# EAGLE design Arduino-Pro-Mini (EAGLE 7.3.0)
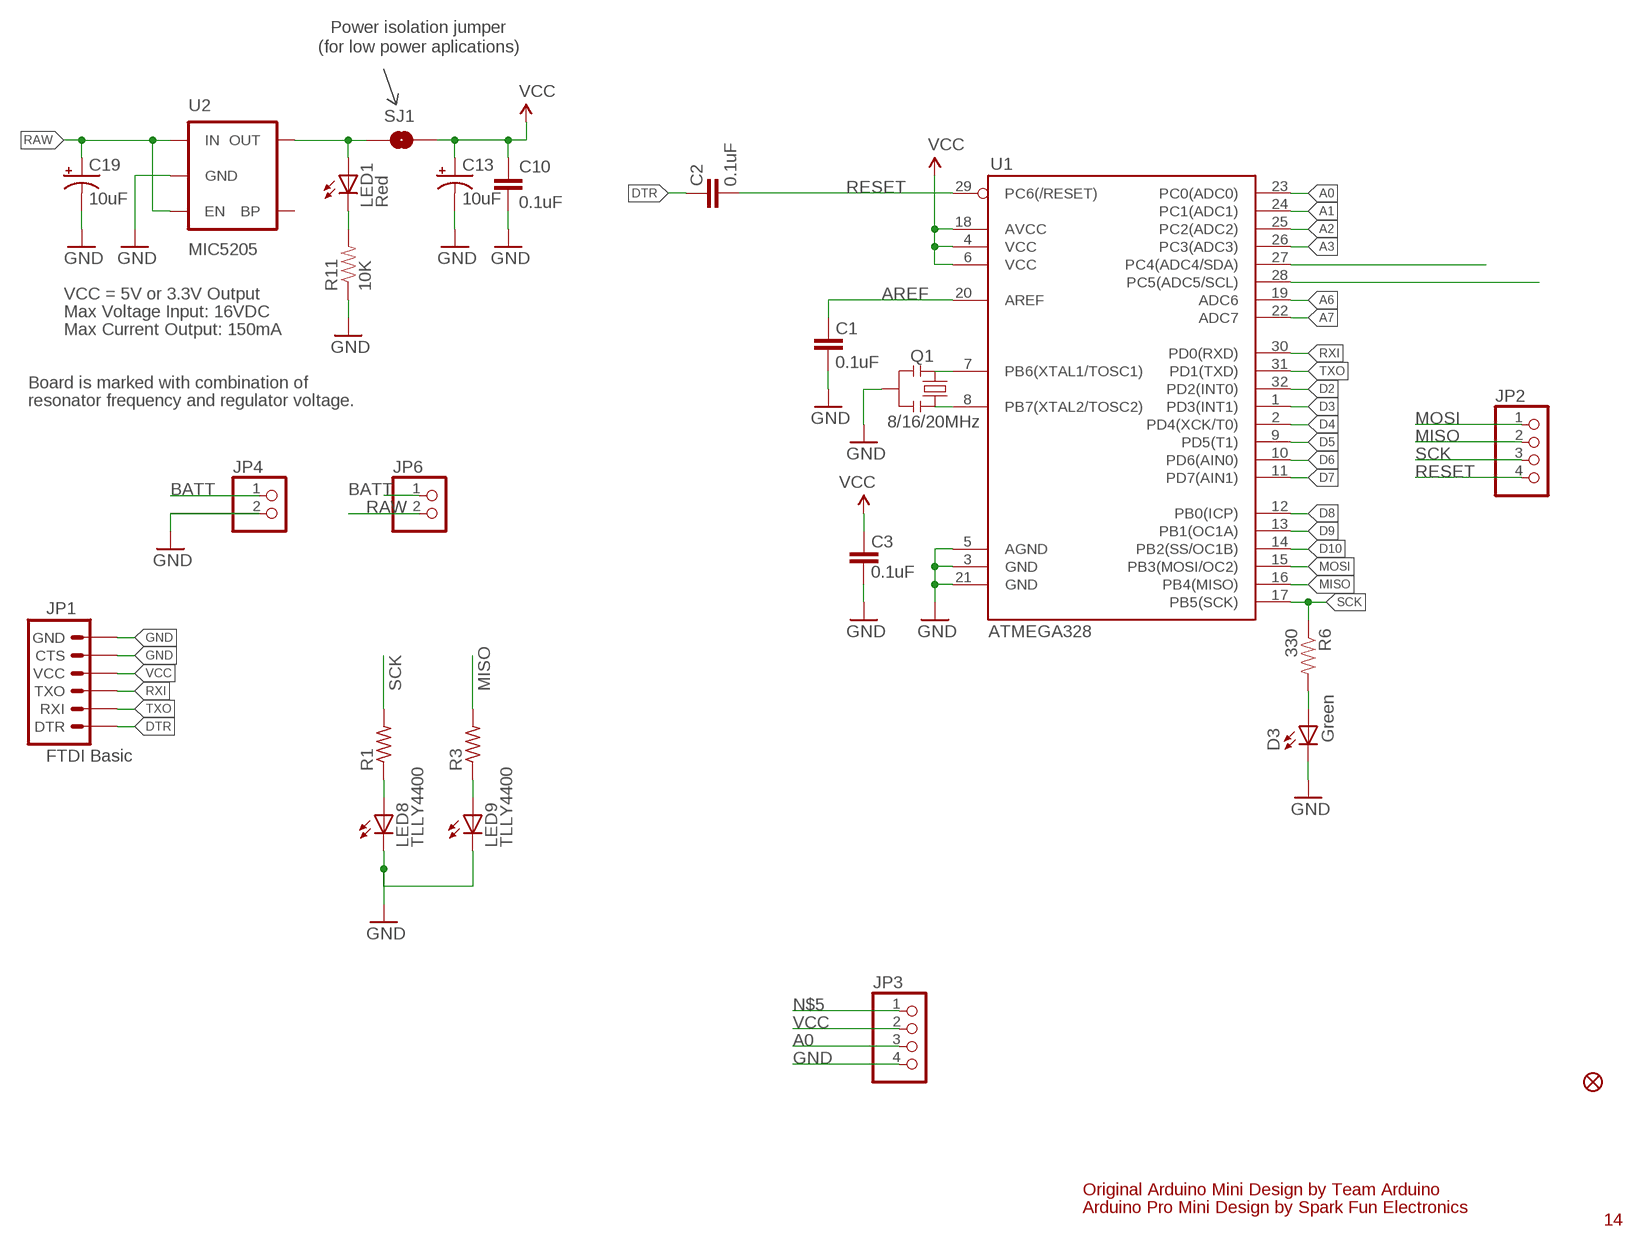
[diagram p0: schematic, sheet 1]

## Parts
C1  0.1uF  CAP0603-CAP  [0603-CAP]
C2  0.1uF  CAP0603-CAP  [0603-CAP]
C3  0.1uF  CAP0603-CAP  [0603-CAP]
C10  0.1uF  CAP0603-CAP  [0603-CAP]
C13  10uF  CAP_POL1206  [EIA3216]
C19  10uF  CAP_POL1206  [EIA3216]
D3  Green  LED  [0603-LED-ALT1]
JP1  FTDI Basic  ARDUINO_SERIAL_PROGRAMPTH  [1X06]
JP2  PINHD-1X4  [1X04]
JP3  PINHD-1X4  [1X04]
JP4  PINHD-1X2  [1X02]
JP5  FIDUCIALUFIDUCIAL  [MICRO-FIDUCIAL]
JP6  PINHD-1X2  [1X02]
LED1  Red  LED  [0603-LED-ALT1]
LED8  TLLY4400  [LED3MM]
LED9  TLLY4400  [LED3MM]
Q1  8/16/20MHz  RESONATOR1:1  [RESONATOR-SMD-1:1]
R1  R-US_R0603  [R0603]
R3  R-US_R0603  [R0603]
R6  330  RESISTOR0603-RES  [0603-RES]
R11  10K  RESISTOR0603-RES  [0603-RES]
SJ1  SOLDERJUMPERNC  [SJ_2S]
U1  ATMEGA328  ATMEGA168  [TQFP32-08]
U2  MIC5205  V_REG_LDOSMD  [SOT23-5]

## Nets
A0: JP3.3 U1.23(PC0(ADC0))
A1: U1.24(PC1(ADC1))
A2: U1.25(PC2(ADC2))
A3: U1.26(PC3(ADC3))
A4: U1.27(PC4(ADC4/SDA))
A5: U1.28(PC5(ADC5/SCL))
A6: U1.19(ADC6)
A7: U1.22(ADC7)
AREF: C1.2 U1.20(AREF)
BATT [vcc]: JP4.1 JP6.1
D2: U1.32(PD2(INT0))
D3: U1.1(PD3(INT1))
D4: U1.2(PD4(XCK/T0))
D5: U1.9(PD5(T1))
D6: U1.10(PD6(AIN0))
D7: U1.11(PD7(AIN1))
D8: U1.12(PB0(ICP))
D9: U1.13(PB1(OC1A))
D10: U1.14(PB2(SS/OC1B))
DTR: C2.2 JP1.1(DTR)
GND [vcc]: C1.1 C3.1 C10.2 C13.C(-) C19.C(-) D3.C JP1.5(CTS) JP1.6(GND) JP3.4 JP4.2 LED8.K(C) LED9.K(C) Q1.2 R11.1 U1.3(GND) U1.5(AGND) U1.21(GND) U2.2(GND)
MISO: JP2.2 R3.2 U1.16(PB4(MISO))
MOSI: JP2.1 U1.15(PB3(MOSI/OC2))
N$1: Q1.3 U1.8(PB7(XTAL2/TOSC2))
N$2: Q1.1 U1.7(PB6(XTAL1/TOSC1))
N$3: LED1.A SJ1.1 U2.5(OUT)
N$4: LED1.C R11.2
N$5: JP3.1
N$7: D3.A R6.2
N$9: LED8.A R1.1
N$16: LED9.A R3.1
RAW [vcc]: C19.A(+) JP6.2 U2.1(IN) U2.3(EN)
RESET: C2.1 JP2.4 U1.29(PC6(/RESET))
RXI: JP1.3(TXO) U1.30(PD0(RXD))
SCK: JP2.3 R1.2 R6.1 U1.17(PB5(SCK))
TXO: JP1.2(RXI) U1.31(PD1(TXD))
VCC: C3.2 C10.1 C13.A(+) JP1.4(VCC) JP3.2 SJ1.2 U1.4(VCC) U1.6(VCC) U1.18(AVCC)
Unconnected: U2.4(BP)

## Notes on the sheet
- Power isolation jumper
- (for low power aplications)
- VCC = 5V or 3.3V Output
- Max Voltage Input: 16VDC
- Max Current Output: 150mA
- Board is marked with combination of
- resonator frequency and regulator voltage.
- Original Arduino Mini Design by Team Arduino
- Arduino Pro Mini Design by Spark Fun Electronics
- 14

## Library data of the parts
C1-C3 C10 = SparkFun:CAP: Capacitor Standard 0603 ceramic capacitor, and 0.1" leaded capacitor.
C13 C19 = SparkFun:CAP_POL: Capacitor Polarized These are standard SMD and PTH capacitors. Normally 10uF, 47uF, and 100uF in electrolytic and tantalum varieties. Always verify the external diameter of the through hole cap, it varies with capacity, voltage, and manufacturer. The EIA devices should be standard.
D3 LED1 = Testing:LED: LEDs Standard schematic elements and footprints for 5mm, 3mm, 1206, and 0603 sized LEDs. 5mm - Spark Fun Electronics SKU : COM-00529 (and others)
JP1 = SparkFun:ARDUINO_SERIAL_PROGRAM
JP2 JP3 = pinhead:PINHD-1X4: PIN HEADER
JP4 JP6 = pinhead:PINHD-1X2: PIN HEADER
JP5 = SparkFun:FIDUCIAL: Fiducial Alignment Points Various fiducial points for machine vision alignment.
LED8 LED9 = led:TLLY4400: Low Current (2mA) LED 3 mm Tinted Diffused Package color YELLOW Source: Data sheet <http://www.farnell.com/datasheets/391098.pdf>; MF: VISHAY SEMICONDUCTOR; OC_FARNELL: 1612439
Q1 = Testing:RESONATOR: Resonator Small SMD resonator. This is the itty bitty 10/20MHz resonators with built in caps. CSTCE10M0G55 and CSTCE20M0V53. Footprint for SMD has been used in SFE production for years, and does work okay. 1:1 is an attempt to get larger fillets on the sides so it will be easier to inspect these solders in our AOI machine. The pads have been minimized to match the actual metal under the resonator. To see this relation, it includes an image import of the bottom side of the component. Imported to scale on layer 200.
R1 R3 = resistor:R-US_: RESISTOR, American symbol
R6 R11 = SparkFun:RESISTOR: Resistor Basic schematic elements and footprints for 0603, 1206, and PTH resistors.
SJ1 = SparkFun-Passives:SOLDERJUMPER: Solder Jumper Standard SMD solder jumper. Used to automate production. Two varients : Normally Open and Normally Closed are the same, but have different paste layers. NC will have a large amount of paste and should jumper during reflow.
U1 = SparkFun:ATMEGA168
U2 = SparkFun:V_REG_LDO: Voltage Regulator LDO Standard 150mA LDO voltage regulator in SOT-23 layout. Micrel part MIC5205. BP (by-pass) pin is used to lower output noise with 470pF cap.

## Net classes
0 default: width 0.203 mm
1 vcc: width 0.254 mm

## Board
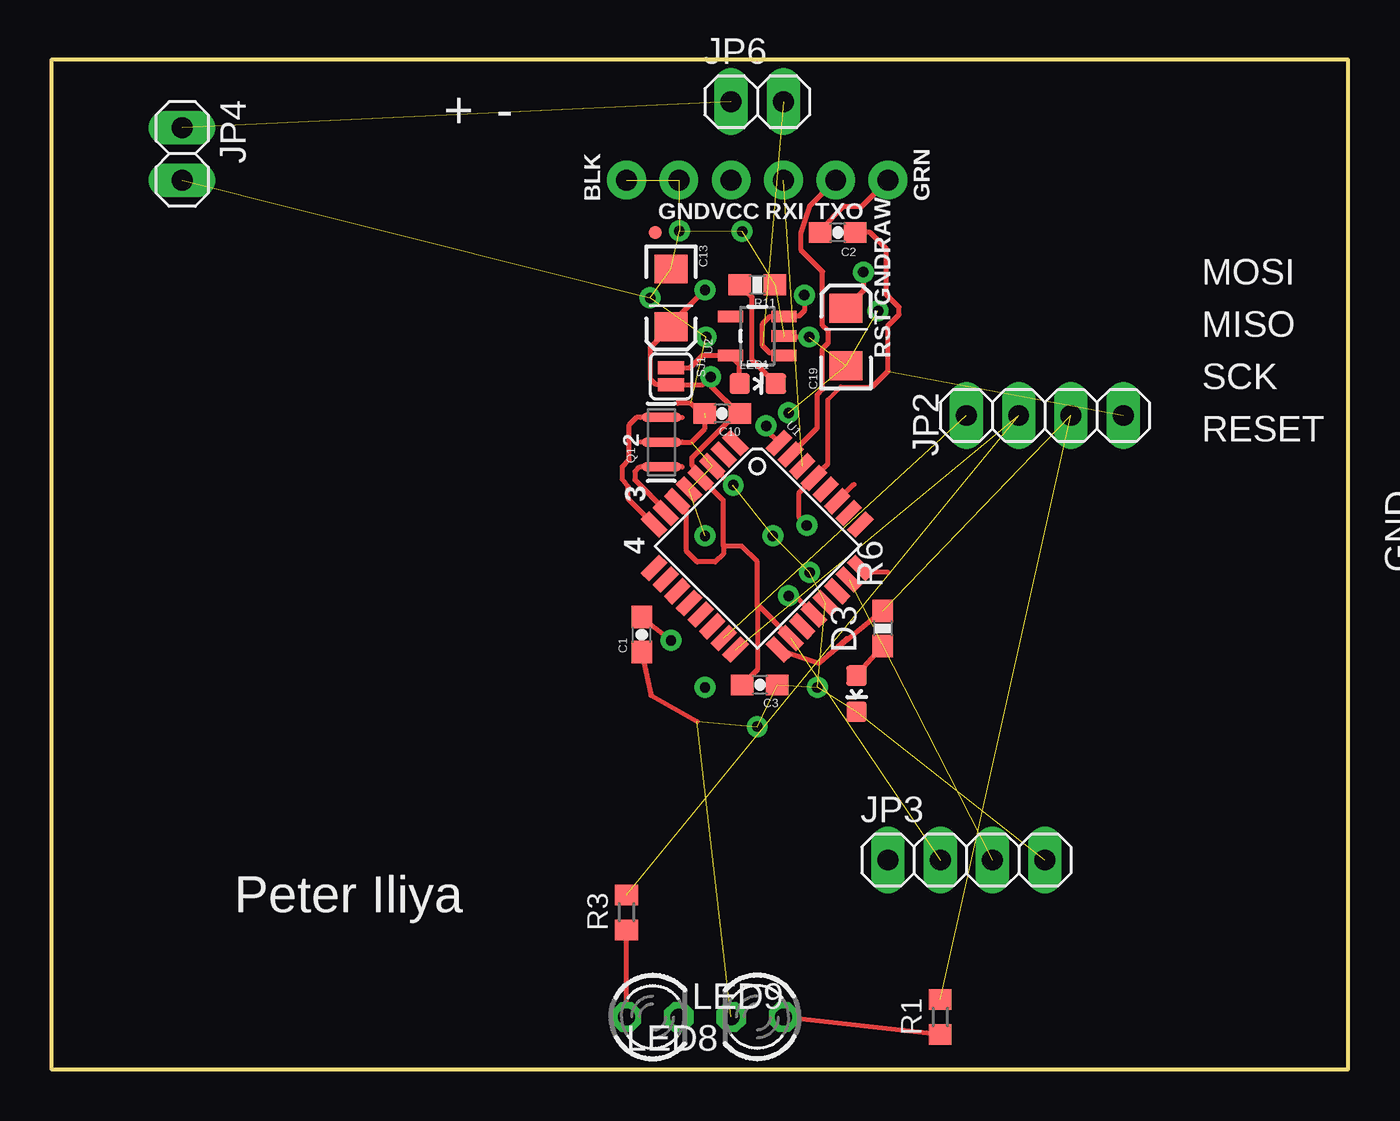
[diagram p1: board, top side]
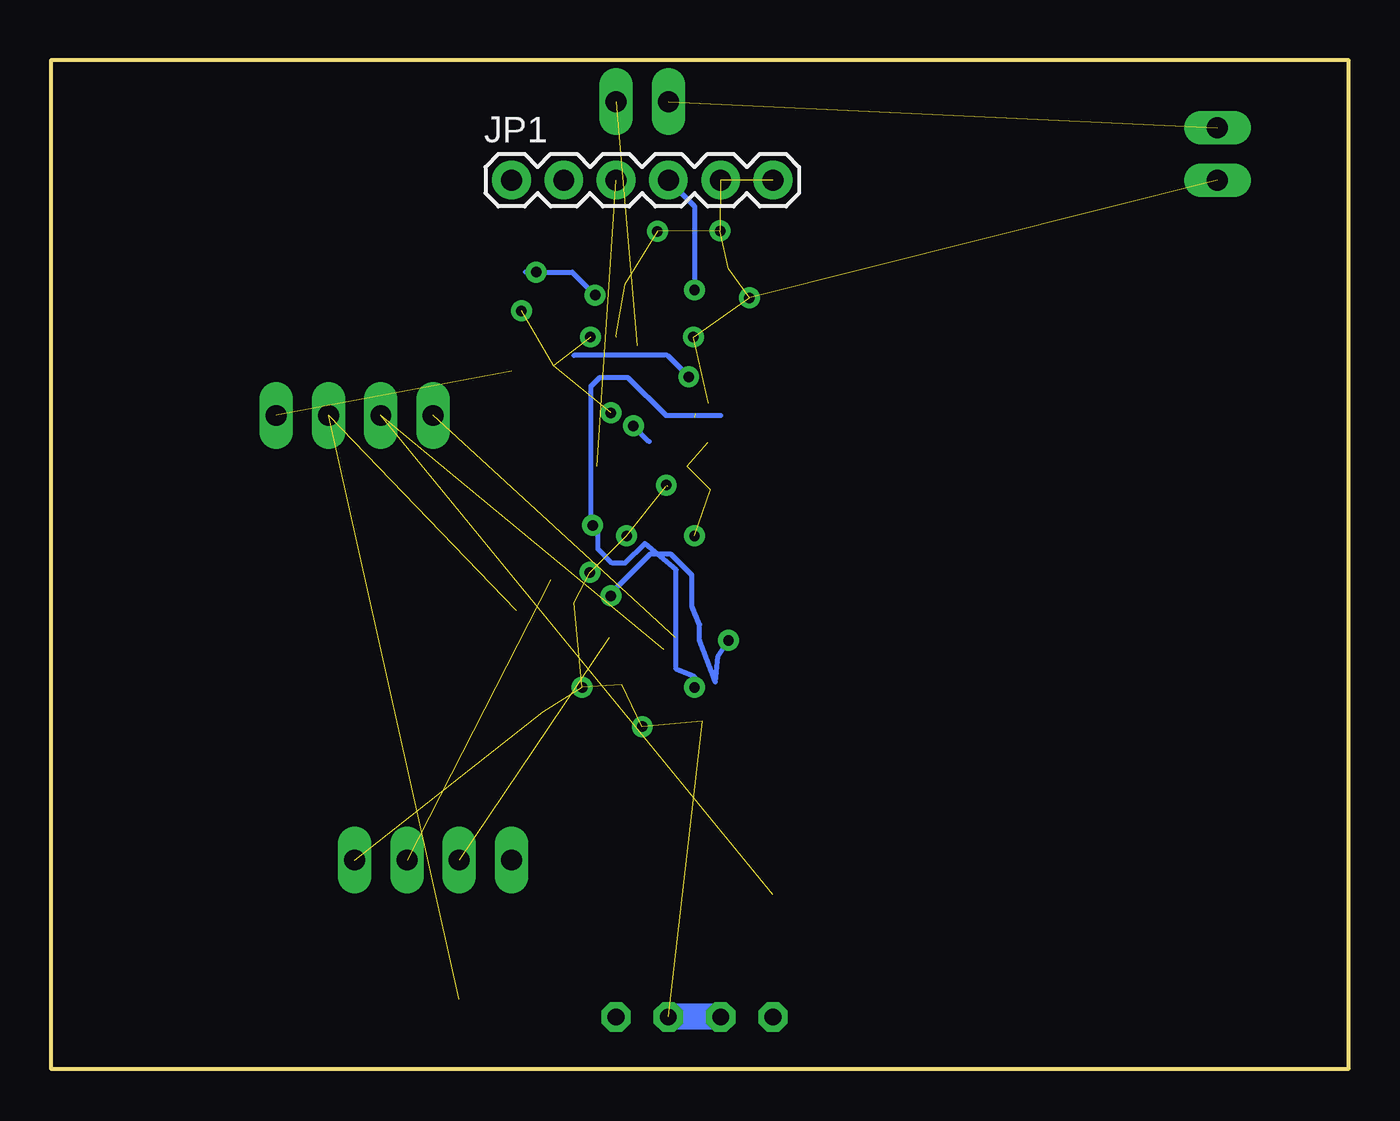
[diagram p2: board, bottom side, seen from below]

Size 62.99 x 49.02 mm. Coordinates in mm from the lower left corner, seen from the top.
Outline: 0,49.02 0,0 62.99,0 62.99,49.02 0,49.02
Copper layers (1*16): Top 0.035mm / dielectric 1.5mm / Bottom 0.035mm
Design rules "SparkFun-2-layer *": minimum track width 7mil, minimum drill 15mil, track to track 8mil, track to pad 8mil, pad to pad 8mil, via to via 8mil, smd to smd 8mil, copper to edge 8mil, drill to drill 8mil, minimum pad ring 12mil, minimum via ring 10mil, stop-mask expansion 4mil, vias tented up to drill 20mil, thermal gap 10mil

### Footprints (pad centres in the part's own frame; a part is rotated, then mirrored left to right if it is on the bottom)
0603-CAP = smd 1.1 x 1: 1 -0.85,0; 2 0.85,0
EIA3216 = smd 1.4 x 1.6: A 1.4,0; C -1.4,0
0603-LED-ALT1 = smd 1 x 1: A 0,-0.877; C 0,0.877
1X06 = drill 1.016 pad 1.88: 1 0,0; 2 2.54,0; 3 5.08,0; 4 7.62,0; 5 10.16,0; 6 12.7,0
1X04 = drill 1.016 long: 1 -3.81,0; 2 -1.27,0; 3 1.27,0; 4 3.81,0
1X02 = drill 1.016 long: 1 -1.27,0; 2 1.27,0
MICRO-FIDUCIAL = smd 0.635 x 0.635: 1 0,0
LED3MM = drill 0.813 octagon: A -1.27,0; K 1.27,0
RESONATOR-SMD-1:1 = smd 0.45 x 1.905: 1 -1.2,0; 2 0,0; 3 1.2,0
R0603 = smd 1 x 1.1: 1 -0.85,0; 2 0.85,0
0603-RES = smd 1.1 x 1: 1 -0.85,0; 2 0.85,0
SJ_2S = smd 0.635 x 1.27: 1 -0.412,0; 2 0.412,0
TQFP32-08 = smd 1.27 x 0.559: 1 -4.293,2.8; 2 -4.293,2; 3 -4.293,1.2; 4 -4.293,0.4; 5 -4.293,-0.4; 6 -4.293,-1.2; 7 -4.293,-2; 8 -4.293,-2.8; 17 4.293,-2.8; 18 4.293,-2; 19 4.293,-1.2; 20 4.293,-0.4; 21 4.293,0.4; 22 4.293,1.2; 23 4.293,2; 24 4.293,2.8 | smd 0.559 x 1.27: 9 -2.8,-4.293; 10 -2,-4.293; 11 -1.2,-4.293; 12 -0.4,-4.293; 13 0.4,-4.293; 14 1.2,-4.293; 15 2,-4.293; 16 2.8,-4.293; 25 2.8,4.293; 26 2,4.293; 27 1.2,4.293; 28 0.4,4.293; 29 -0.4,4.293; 30 -1.2,4.293; 31 -2,4.293; 32 -2.8,4.293
SOT23-5 = smd 0.55 x 1.2: 1 -0.95,-1.3; 2 0,-1.3; 3 0.95,-1.3; 4 0.95,1.3; 5 -0.95,1.3

### Placement (x,y rotation side)
C1  28.68,21.11 90 top
C2  38.2,40.64 180 top
C3  34.42,18.67 180 top
C10  32.59,31.85 180 top
C13  30.1,37.47 270 top
C19  38.61,35.56 90 top
D3  39.12,18.24 180 top
JP1  40.64,43.18 0 bottom
JP2  48.26,31.75 0 top
JP3  44.45,10.16 0 top
JP4  6.35,44.45 270 top
JP5  29.34,40.64 0 top
JP6  34.29,46.99 0 top
LED1  34.32,33.3 270 top
LED8  34.29,2.54 180 top
LED9  29.21,2.54 0 top
Q1  29.64,30.45 90 top
R1  43.18,2.54 90 top
R3  27.94,7.62 90 top
R6  40.39,21.41 270 top
R11  34.29,38.1 180 top
SJ1  30.1,33.66 270 top
U1  34.29,25.4 315 top
U2  34.29,35.61 90 top

### Tracks (layer width: path | path; a pad name or v marks a point on that pad's centre or on a via)
A0  (1 unrouted)
A1
  Top 0.254: 40.64,24.13 39.37,24.13 39.3,24.2 U1.24
A4
  Top 0.254: U1.27 38.99,28.4 | 38.99,28.4
AREF  (via drill 0.51)
  Top 0.254: 36.14,22.99 v35.81,22.99 36.14,22.99 | v30.1,20.83 30.09,20.83 C1.2 | U1.20 36.14,22.99
  Bottom 0.254: v35.81,22.99 35.81,23.11 33.91,25.02 32.89,25.02 31.88,24 31.88,22.48 31.5,21.59 31.5,20.83 30.73,18.8 30.61,20.07 v30.1,20.83
BATT  (1 unrouted)
D2  (via drill 0.51)
  Top 0.254: U1.32 34.72,31.04 v34.72,31.24
  Bottom 0.254: 33.96,30.48 v34.72,31.24
DTR
  Top 0.254: JP1.1 39.37,41.91 38.48,41.91 37.35,40.78 C2.2
GND  (via drill 0.51)  (29 unrouted)
  Top 0.254: v36.8,35.56 35.56,35.56 | C1.1 29.12,18.16 31.37,16.89 | U1.3 33.07,28.32 33.15,28.32 | 30.66,30.45 31.09,30.45 31.75,31.12 31.75,31.65 31.06,32.33 30.43,32.33 30.4,32.36 | C10.2
  Bottom 1.27: LED9.K LED8.K
  other vias: 36.83,24.13 35.05,25.91 34.29,16.64 30.51,40.72 35.81,31.88 31.75,25.91 40.16,36.83 33.12,28.37 29.08,37.47 31.8,35.56 33.55,40.69 37.21,18.54
MISO  (2 unrouted)
MOSI  (1 unrouted)
N$1
  Top 0.254: U1.8 28.02,27.71 28.02,28.3 27.74,28.65 27.74,29.26 28.07,29.59 28.07,31.29 28.43,31.66 28.63,31.66
N$2
  Top 0.254: 29.56,27.3 U1.7 29.84,27.13 28.35,28.63 28.35,29.03 28.58,29.26 28.63,29.26
N$3
  Top 0.254: SJ1.1 31.02,34.07 31.61,34.66 U2.5 33.44,34.21 LED1.A
N$4
  Top 0.254: R11.2 34.04,37.5 34.04,34.46 LED1.C
N$7
  Top 0.254: D3.A R6.2
N$9
  Top 0.254: LED8.A R1.1
N$16
  Top 0.254: LED9.A R3.1
RAW  (via drill 0.51)  (1 unrouted)
  Top 0.254: C19.A 39.45,37.8 v39.45,38.71 | U2.1 35.48,34.77 34.9,34.77 34.54,35.13 34.54,36.2 34.91,36.56 U2.3 35.6,36.58 36.32,36.58 36.58,36.83 v36.58,37.59
  Bottom 0.254: 39.98,38.71 v39.45,38.71 37.69,38.71 v36.58,37.59
RESET  (via drill 0.51)  (1 unrouted)
  Top 0.203: 39.88,33.15 38.35,33.15 37.72,32.51
  Top 0.254: 37.72,32.51 37.72,29.4 U1.29 36.32,28 36.32,26.8 v36.7,26.42 | 39.88,33.15 40.64,33.91 40.64,36.12 41.17,36.65 41.17,37.01 40.56,37.62 40.56,39.85 39.78,40.64 C2.1
  Bottom 0.254: v31.75,18.54 31.75,19.05 32.64,19.43 32.64,24.26 34.16,25.53 35.12,24.58 35.75,24.58 36.45,25.27 36.45,26.16 v36.7,26.42 36.78,26.49 36.78,33.17 36.35,33.6 35,33.6 33.15,31.75 30.48,31.75
RXI  (1 unrouted)
SCK  (2 unrouted)
  Top 0.254: U1.17 37.28,19.72 | 37.28,19.72 38.62,20.92 | R6.1 37.28,19.72
TXO
  Top 0.254: JP1.2 36.83,41.91 36.42,40.64 36.42,39.78 37.46,38.73 37.46,36.12 37.74,35.84 37.74,35.28 37.46,35 37.46,33.02 37.21,32.77 37.21,31.15 | U1.31 37.21,31.15 | 37.21,31.15
VCC  (via drill 0.51)  (1 unrouted)
  Top 0.254: 34.29,22.57 34.34,22.52 34.29,22.48 | 34.29,22.48 34.29,22.57 | 34.29,22.57 34.29,24.64 33.53,25.4 32.64,25.4 | 32.64,25.4 32.64,25.02 32.26,24.64 31.37,24.64 30.86,25.15 30.86,27.13 U1.6 | 32.64,25.4 32.64,27.62 U1.4 | 34.29,22.48 34.29,19.39 C3.2 | U1.18 34.29,22.57 | v31.75,37.85 30.1,36.2 C13.A 29.08,35.05 29.08,33.53 29.34,33.27 30.07,33.27 SJ1.2 31.64,33.24 v32.03,33.63 32.03,33.2 33.38,31.85 C10.1 33.27,31.85 31.12,29.69 31.12,29.34 31.54,28.92 U1.4 | 31.54,28.74 U1.4
  Bottom 0.254: 37.61,34.67 33.07,34.67 v32.03,33.63 | v31.75,37.85 31.75,41.91 JP1.4

### Text on the board
tPlace: BLK | GRN | GND | VCC | RXI | TXO | RAW | GND | RST | 2 | 3 | 4
tNames: + | - | MOSI | MISO | SCK | RESET | GND | Peter Iliya
tValues: Valid combinations: | 168V / 3.3V Reg / 8MHz | 168 / 5V Reg / 16MHz | 168 / 5V Reg / 20MHz | Mark back accordingly | Arduino Pro Mini